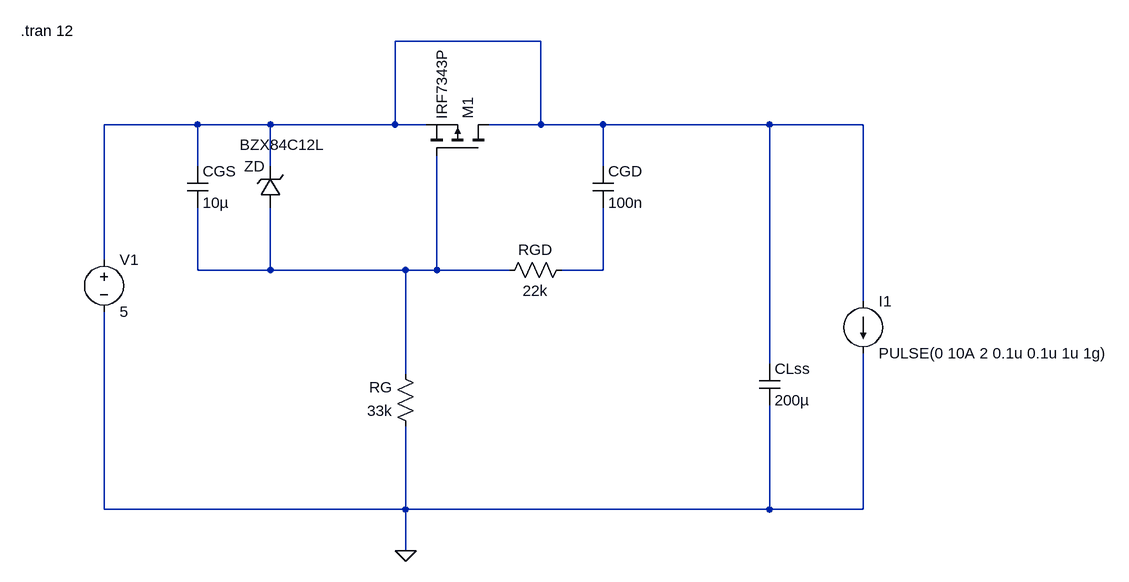
[diagram p0: schematic SoftStart.asc]
SoftStart.asc, the LTspice schematic file:
Version 4
SHEET 1 1520 800
WIRE 640 0 416 0
WIRE 112 128 -32 128
WIRE 224 128 112 128
WIRE 416 128 416 0
WIRE 416 128 224 128
WIRE 464 128 416 128
WIRE 640 128 640 0
WIRE 640 128 560 128
WIRE 736 128 640 128
WIRE 992 128 736 128
WIRE 1136 128 992 128
WIRE 112 192 112 128
WIRE 224 192 224 128
WIRE 736 192 736 128
WIRE -32 336 -32 128
WIRE 112 352 112 256
WIRE 224 352 224 256
WIRE 224 352 112 352
WIRE 432 352 224 352
WIRE 480 352 480 176
WIRE 480 352 432 352
WIRE 592 352 480 352
WIRE 736 352 736 256
WIRE 736 352 672 352
WIRE 1136 400 1136 128
WIRE 992 496 992 128
WIRE 432 512 432 352
WIRE -32 720 -32 416
WIRE 432 720 432 592
WIRE 432 720 -32 720
WIRE 992 720 992 560
WIRE 992 720 432 720
WIRE 1136 720 1136 480
WIRE 1136 720 992 720
WIRE 432 784 432 720
FLAG 432 784 0
SYMBOL Voltage -32 320 R0
SYMATTR InstName V1
SYMATTR Value 5
SYMBOL Cap 96 192 R0
SYMATTR InstName CGS
SYMATTR Value 10µ
SYMBOL zener 240 256 R180
WINDOW 0 24 64 Left 2
WINDOW 3 -68 97 Left 2
SYMATTR InstName ZD
SYMATTR Value BZX84C12L
SYMBOL Res 688 336 R90
WINDOW 0 0 56 VBottom 2
WINDOW 3 32 56 VTop 2
SYMATTR InstName RGD
SYMATTR Value 22k
SYMBOL Res 448 608 R180
WINDOW 0 36 76 Left 2
WINDOW 3 36 40 Left 2
SYMATTR InstName RG
SYMATTR Value 33k
SYMBOL Cap 720 192 R0
SYMATTR InstName CGD
SYMATTR Value 100n
SYMBOL Cap 976 496 R0
SYMATTR InstName CLss
SYMATTR Value 200µ
SYMBOL pmos 560 176 M270
SYMATTR InstName M1
SYMATTR Value IRF7343P
SYMBOL current 1136 400 R0
SYMATTR InstName I1
SYMATTR Value PULSE(0 10A 2 0.1u 0.1u 1u 1g)
TEXT -160 -16 Left 2 !.tran 12

The netlist it stands for:
* SoftStart.asc
V1 N001 0 5
CGS N001 N002 10µ
D§ZD N002 N001 BZX84C12L
RGD N003 N002 22k
RG 0 N002 33k
CGD N001 N003 100n
CLss N001 0 200µ
M1 N001 N002 N001 N001 IRF7343P
I1 N001 0 PULSE(0 10A 2 0.1u 0.1u 1u 1g)
.model D D
.lib standard.dio
.model NMOS NMOS
.model PMOS PMOS
.lib standard.mos
.tran 12
.backanno
.end